# Altium project PowerCard_CDH.PrjPcb
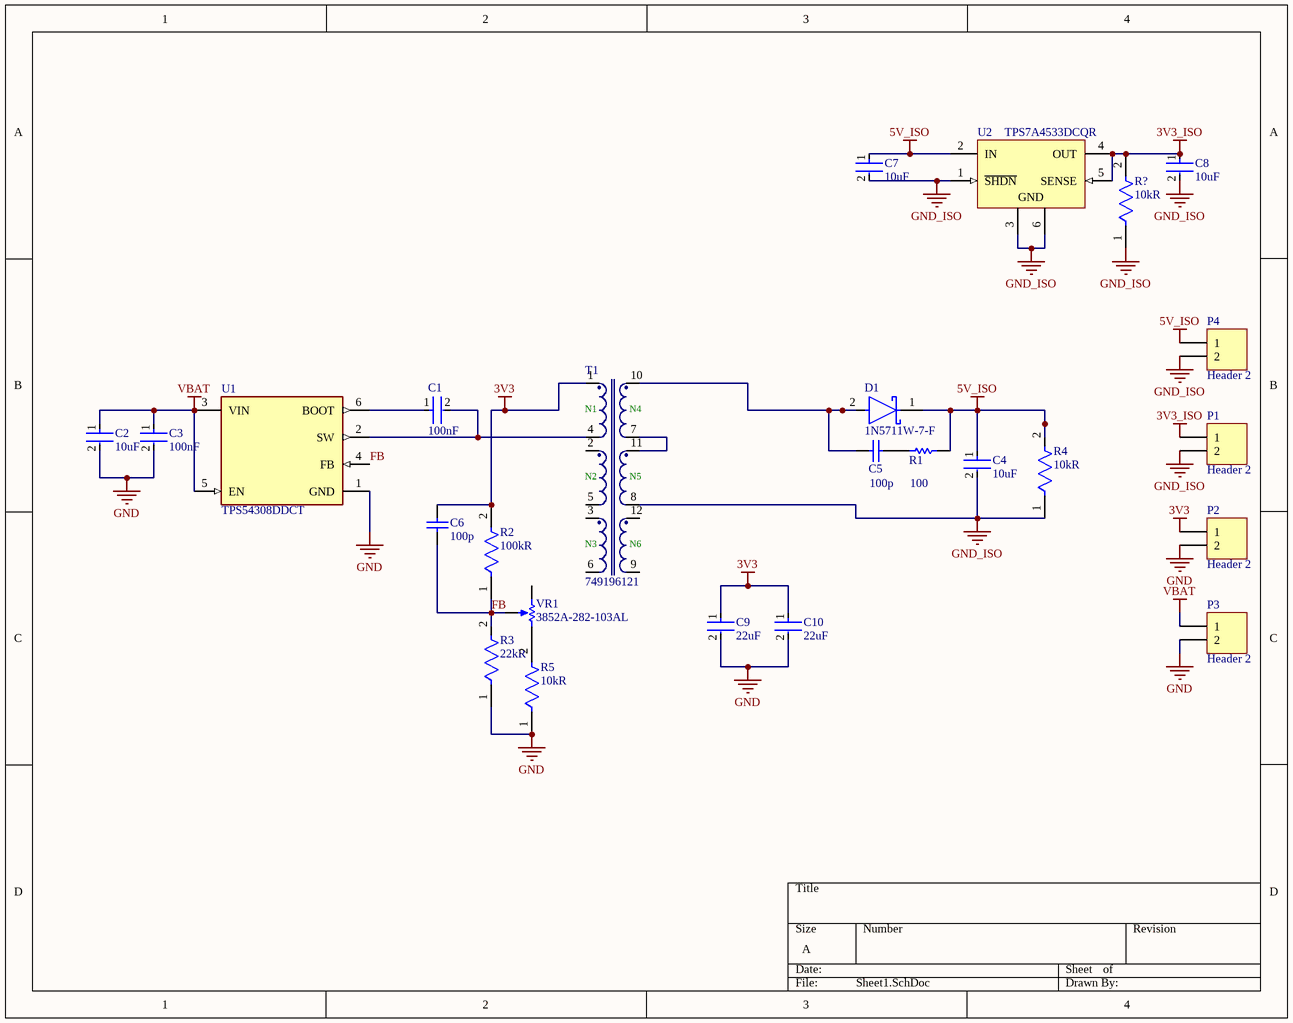
[diagram p0: Sheet1.SchDoc]
1 sheet, 25 parts. Net scope: global (net labels, ports and power ports of the same name join across sheets).
Board file: PCB1.PcbDoc

## Sheet Sheet1.SchDoc
size A; SheetNumber: 1; SheetTotal: 1

### Parts
C1  Capacitance: 100nF  [FP-C0603C104K5RECAUTO-MFG]  (hidden comment: C0603C104K5RECAUTO)
C2  value 10uF  [FP-C0805C-DG-MFG]  (hidden comment: C0805C106K8PACTU)
C3  Capacitance: 100nF  [FP-C0603C104K5RECAUTO-MFG]  (hidden comment: C0603C104K5RECAUTO)
C4  value 10uF  [FP-C0805C-DG-MFG]  (hidden comment: C0805C106K8PACTU)
C5  C: 100p  [CAPC1608X90X35NL10T15]  (hidden comment: GRM1885C1H101JA01D)
C6  C: 100p  [CAPC1608X90X35NL10T15]  (hidden comment: GRM1885C1H101JA01D)
C7  value 10uF  [FP-C0805C-DG-MFG]  (hidden comment: C0805C106K8PACTU)
C8  value 10uF  [FP-C0805C-DG-MFG]  (hidden comment: C0805C106K8PACTU)
C9  Capacitance: 22uF  [FP-GRM21B-0_15-MFG]  (hidden comment: GRM21BR60J226ME39L)
C10  Capacitance: 22uF  [FP-GRM21B-0_15-MFG]  (hidden comment: GRM21BR60J226ME39L)
D1  1N5711W-7-F  [FP-SOD123-IPC_A]
P1  Header 2  [HDR1X2]
P2  Header 2  [HDR1X2]
P3  Header 2  [HDR1X2]
P4  Header 2  [HDR1X2]
R1  R: 100  [RESC2013X60X40ML20T25]  (hidden comment: ERA6AEB101V)
R2  Resistance: 100kR  [FP-ERJ2RK-MFG]  (hidden comment: ERJ-2RKF1003X)
R3  Resistance: 22kR  [FP-CRCW0603-HPe3-IPC_B]  (hidden comment: CRCW060322K0FKEAHP)
R4  Resistance: 10kR  [FP-CRCW0805-e3-MFG]  (hidden comment: CRCW080510K0FKEA)
R5  Resistance: 10kR  [FP-CRCW0805-e3-MFG]  (hidden comment: CRCW080510K0FKEA)
R6  Resistance: 10kR  [FP-CRCW0805-e3-MFG]  (hidden comment: CRCW080510K0FKEA)
T1  749196121  [ER11_5]
U1  TPS54308DDCT  [FP-DDC0006A-IPC_A]
U2  TPS7A4533DCQR  [DCQ0006A_M]
VR1  3852A-282-103AL  [BOUR-3852A-282-103AL-3_V]

### Nets
3V3: C6.2 C9.1 C10.1 P2.1 R2.2 T1.1
3V3_ISO: C8.1 P1.1 R6.2 U2.4(OUT) U2.5(SENSE)
5V_ISO: C4.1 C7.1 D1.1(C) P4.1 R1.2 R4.2 U2.2(IN)
GND: C2.2 C3.2 C9.2 C10.2 P2.2 P3.2 R3.1 R5.1 U1.1(GND)
GND_ISO: C4.2 C7.2 C8.2 P1.2 P4.2 R4.1 R6.1 T1.8 U2.1(~{SHDN}) U2.3(GND) U2.6(GND)
VBAT: C2.1 C3.1 P3.1 U1.3(VIN) U1.5(EN)
FB: C6.1 R2.1 R3.2 U1.4(FB) VR1.2(S)
NetC1_1: C1.1 U1.6(BOOT)
NetC1_2: C1.2 T1.4 U1.2(SW)
NetC5_1: C5.1 D1.2(A) T1.10
NetC5_2: C5.2 R1.1
NetR5_2: R5.2 VR1.3(CW)
NetT1_7: T1.7 T1.11

Not connected (* = marked no-connect by the designer): T1 2 3 5 6 9 12; VR1 1(CCW)

### Notes on the sheet
- (in symbol CMP-1376-00020-1) N1; N4; N2; N5; N3; N6

### Library data of the parts
C1 C3 = CMP-03020-034675-1: CAP CER 0.10UF 50V X7R 0603; Tolerance: 10%; Sampling Rate: 4000S/s; Interface: SPI; Number of A/D Converters: 1; Number of Bits: 16; Case Code (Imperial): 0603; Case/Package: 0603; Min Operating Temperature: -55°C; Packaging: Tape and Reel; Mount: Surface Mount; RoHS Compliant: Yes; Case Code (Metric): 1608; Max Operating Temperature: 125°C; Voltage Rating: 50V; Ratings: AEC-Q200
C2 C4 C7 C8 = CMP-2007-03243-2: CAP CER 10UF 10V X5R 0805; Manufacturer: Kemet; 3DS Part Number: 220-00001; Tolerance: 10%; Temperature Coefficient: 15%; Material: Ceramic; Device Class L2: Capacitors; Device Class L1: Passive Components; ComponentLink2URL: https://content.kemet.com/datasheets/KEM_C1006_X5R_SMD.pdf; Height: 1.4mm; Lead Free: Yes; Manufacturer Part Number: C0805C106K8PACTU; Digikey Description: CAP CER 10UF 10V X5R 0805; Octopart: https://octopart.com/c0805c106k8pactu-kemet-98697; Capacitance: 10uF; Temperature Range Low: -55°C; Temperature: -55°C to +85°C; Automotive: No; Mouser Description: CAP CER 10UF 10V X5R 0805; Ipc Land Pattern Name: CAPC200125X125; Temperature Range High: +85°C; Voltage: 10V; RoHS: TRUE; Device Class L3: Ceramic Capacitors; ComponentLink2Description: Datasheet; Voltage Rating: 10V; Package: C0805C-DG; Temperature Characteristic: X5R; Category: Cap
C5 C6 = CMP-2006-02595-1: Manufacturer: Murata; Part Number: GRM1885C1H101JA01D
C9 C10 = CMP-2007-03385-2: Chip Multilayer Ceramic Capacitors for General Purpose, 0805, 22uF, X5R, 15%, 20%, 6.3V; Material: Ceramic; Max Operating Temperature: 85°C; Voltage: 6.3V; Min Operating Temperature: -55°C; Case/Package: 0805; Thickness: 0.053inch; Dielectric: X5R; Packaging: Tape and Reel; Depth: 1.25mm; Termination: SMD/SMT; Voltage Rating (DC): 6.3V; Radiation Hardening: No; Tolerance: 20%; Mount: Surface Mount; Lead Free: Lead Free; Package Quantity: 1; REACH SVHC: No SVHC; Voltage Rating: 6.3V; Length: 2mm; Case Code (Imperial): 0805; Case Code (Metric): 2012; Width: 0.049inch; Height: 1.25mm
D1 = CMP-12790-000071-1: DIODE SCHOTTKY 70V 333MW SOD123; Max Current Rating: 15mA; Capacitance: 2pF; Element Configuration: Single; Reverse Recovery Time: 1ns; Forward Voltage: 1V; Polarity: Standard; Peak Reverse Current: 200nA; Max Forward Surge Current (Ifsm): 1mA; Length: 2.85mm; Termination: SMD/SMT; Max Repetitive Reverse Voltage (Vrrm): 70V; Max Operating Temperature: 125°C; Packaging: Tape and Reel; Number of Pins: 2; Voltage Rating (DC): 70V; Lead Free: Lead Free; Power Rating: 333mW; Max Power Dissipation: 333mW; Power Dissipation: 333mW; Mount: Surface Mount; Radiation Hardening: No; REACH SVHC: No SVHC; Weight: 0.000353oz; Contact Plating: Tin; Output Current: 15mA; Height: 1.25mm; Package Quantity: 3000; Forward Current: 15mA; Current Rating: 15mA; Min Operating Temperature: -55°C; Width: 1.7mm
P1-P4 = Header 2: Header, 2-Pin; LatestRevisionDate: 17-Jul-2002; LatestRevisionNote: Re-released for DXP Platform.; Publisher: Altium Limited
R1 = CMP-2001-00580-1: Manufacturer: Panasonic; Part Number: ERA6AEB101V
R2 = CMP-2002-00608-4: RES SMD 100K OHM 1% 1/10W 0402; Voltage Rating (DC): 50V; Power Rating: 100mW; Temperature Coefficient: 100ppm/°C; Case/Package: 0402; Length: 1mm; Package Quantity: 1; Radiation Hardening: No; Case Code (Metric): 1005; Contact Plating: Tin; Mount: Surface Mount; Depth: 0.5mm; Max Operating Temperature: 155°C; Lead Free: Lead Free; Width: 0.5mm; Composition: Thick Film; Case Code (Imperial): 0402; Tolerance: 1%; Termination: SMD/SMT; Number of Pins: 2; Height: 0.35mm; Voltage Rating: 50V; Military Standard: Not; REACH SVHC: No SVHC; Packaging: Tape and Reel; Min Operating Temperature: -55°C; Max Power Dissipation: 100mW; Features: Automotive AEC-Q200; Number of Terminations: 2
R3 = CMP-02407-004495-1: RES Thick Film, 22kΩ, 1%, 0.33W, 100ppm/°C, 0603; Voltage Rating: 75V; Max Power Dissipation: 250mW; Number of Terminations: 2; Composition: Thick Film; Max Operating Temperature: 155°C; Case/Package: 0603; Depth: 0.85mm; Voltage Rating (DC): 75V; Lead Free: Lead Free; Package Quantity: 5000; Termination: SMD/SMT; Length: 1.6mm; Contact Plating: Tin; Case Code (Imperial): 0603; Height: 0.022inch; Military Standard: Not; Features: Automotive AEC-Q200; Tolerance: 1%; Case Code (Metric): 1608; Min Operating Temperature: -55°C; Mount: Surface Mount; Power Rating: 250mW; Radiation Hardening: No; Width: 0.033inch; Packaging: Tape and Reel; Temperature Coefficient: 100ppm/°C
R4-R6 = CMP-2001-04908-2: RES Thick Film, 10kΩ, 1%, 0.125W, 100ppm/°C, 0805; Voltage Rating (DC): 150V; Power Rating: 125mW; Weight: 0.000194oz; Package Quantity: 5000; Military Standard: Not; Max Operating Temperature: 155°C; Temperature Coefficient: 100ppm/°C; Contact Plating: Tin; Width: 1.25mm; Height: 0.45mm; Radiation Hardening: No; Tolerance: 1%; Min Operating Temperature: -55°C; Voltage Rating: 150V; Length: 2mm; Depth: 1.25mm; Termination: SMD/SMT; Packaging: Tape and Reel; Case/Package: 0805; Case Code (Metric): 2012; Lead Free: Lead Free; Case Code (Imperial): 0805; Composition: Thick Film
T1 = CMP-1376-00020-1: Flexible Transformer for DC/DC Converter WE-FLEX, L=14.7µH; Manufacturer: Wuerth Elektronik; Lbase: 14.7ÂµH; ComponentLink1URL: http://www.we-online.com; PartNumber: 749196121; ComponentLink2URL: http://www.we-online.de/katalog/media/pdf/749196121.pdf; ComponentLink1Description: Manufacturer URL; PackageReference: ER11_5; ComponentLink2Description: Datasheet
U1 = CMP-04918-000241-1: IC REG BUCK ADJ 3A TSOT23-6; Max Input Voltage: 28V; Synchronous Rectifier: Yes; Max Output Voltage: 26V; Switching Frequency: 350kHz; Number of Outputs: 1; Output Configuration: Positive; Output Type: Adjustable; Min Input Voltage: 4.5V; Min Output Voltage: 1V; Min Operating Temperature: -40°C; Case/Package: SOT-23-6; Mount: Surface Mount; RoHS Compliant: Yes; Max Operating Temperature: 125°C; Output Current: 3A; Packaging: Tape and Reel
U2 = CMP-0395-00360-2: Single Output Fast Transient Response LDO, 1.5 A, Fixed 3.3 V Output, 2.1 to 20 V Input, 6-pin SOT-223 (DCQ), -40 to 125 degC, Green (RoHS & no Sb/Br); Manufacturer: Texas Instruments; Vout Adj(Max)(V): 3.3; Vin(Max)(V): 20; Accuracy(%): 1; SubFamily: Single Channel LDO; Vin(Min)(V): 2.1; Iout(Max)(A): 1.5; Vdo(Typ)(mV): 300; Eco-Plan: Green (RoHS & no Sb/Br); Mounting Technology: Surface Mount; PackageDescription: 6-Pin Plastic Small Outline, Body 3.5 x 6.5 mm, Pitch 1.27 mm; ComponentLink2URL: http://www.ti.com/general/docs/lit/getliterature.tsp?genericPartNumber=TPS7A4533&fileType=pdf; PackageReference: DCQ0006A; ComponentLink3Description: Package Specification; ComponentLink2Description: Datasheet; Fixed Output Options(V): 3.3; Iq(Typ)(mA): 1; ComponentLink1URL: http://www.ti.com/; PartNumber: TPS7A4533DCQR; ComponentLink1Description: Manufacturer URL; PackageVersion: 4202109/D; Vout Adj(Min)(V): 3.3; DatasheetVersion: SLVS720D; ComponentLink3URL: http://www.ti.com/litv/pdf/mpds098c
VR1 = CMP-2000-05079-1: Diameter Panel Control, 10 KOhm, +/- 10%, 2 W, -1 to 125 degC, 3-Pin THD, RoHS, Bulk; Manufacturer: Bourns; Temperature Coefficient: ±150ppm/degC; Number of Gangs: 1; Other Names: 3852A282103AL; Actuator Length: 0.875"(22.23mm); Resistive Material: Cermet; PCN Design/Specification: PBTResinJun/2011; Rotation: 280deg; PCN Other: MultipleChanges01/Dec/2012; Catalog Drawings: 3852SeriesSide1 / 3852SeriesSide2; Online Catalog: 3852and3856Series; Associated Product: 36-8560-ND / -KNOBINSTRUMW/DIALRND.9"DIA / 36-8555-ND / -KNOBINSTRUMSKIRTEDRND.7"DIA / 36-8556-ND / -KNOBINSTRUMSKIRTEDRND.9"DIA / 36-8565-ND / -KNOBINSTRUMDBLBARRND.7"DIA / 36-8566-ND / -KNOBINSTRUMDBLBARRND.9"DIA / 36-8568-ND / -KNOBINSTRUMSGLBARRND.7"DIA / 36-8569-ND / -KNOBINSTRUMSGLBARRND.9"DIA / 36-8559-ND / -KNOBINSTRUMW/DIALRND.7"DIA / 226-1006-ND / -KNOBBLKGLOSS.75"DIA.250"SHAFT / 226-1007-ND / -KNOBBLKGLOSS.925"DIA.250"SHAFT / 226-1011-ND / -KNOBBLKGLOS; Actuator Diameter: 0.250"(6.35mm); Built in Switch: None; Resistance (Ohms): 10k; Power (Watts): 2W; Actuator Type: Slotted; Standard Package: 45; Tolerance: ±10%; Taper: Linear; Series: 3852; Packaging: Bulk; Category: Potentiometers,VariableResistors; Bushing Thread: 3/8-32; Datasheet URL: https://datasheet.ciiva.com/11831/0900766b80f93b4b-11831016.pdf; Datasheet Version: Sep-14; Number of Turns: 1; Family: RotaryPotentiometers,Rheostats; Termination Style: SolderLug; RoHS Information: 3852A-LMaterialDeclaration; Mounting Type: PanelMount; Manufacturer URL: http://www.bourns.com/